# Altium schematic sheet Top.SchDoc
size A4; SheetNumber: 1; SheetTotal: 3
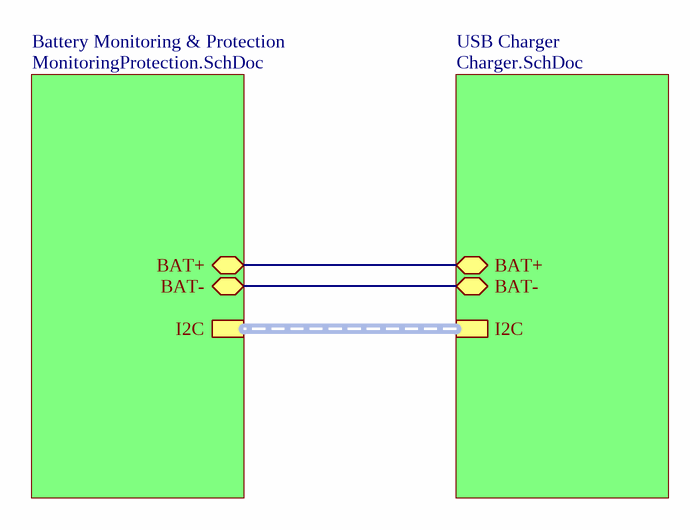
[diagram p0: Top.SchDoc]

## Sub-sheets
Battery Monitoring & Protection = MonitoringProtection.SchDoc: BAT+ (bidir), I2C (harness I2C), BAT- (bidir)
USB Charger = Charger.SchDoc: BAT+ (bidir), I2C (harness I2C), BAT- (bidir)

## Nets
(unnamed): sheet Battery Monitoring & Protection/BAT+, sheet USB Charger/BAT+
(unnamed): sheet Battery Monitoring & Protection/BAT-, sheet USB Charger/BAT-

## Buses and harness runs
harness sheet Battery Monitoring & Protection/I2C = sheet USB Charger/I2C

## Notes on the sheet
- Project:
- Board:
- Title:
- Size:
- Sheet:
- A4
- of
- Drawn by:
- Revision:
- Date:
- Variant:
- Source Engineers GmbH | CH-3012 Bern
- File: